# Altium schematic sheet BS-02-A1AJ0101_BS-02-A1AJ010.schdoc
size 127 x 99 mm
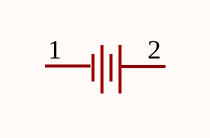
[diagram p0: BS-02-A1AJ0101_BS-02-A1AJ010.schdoc]

## Parts
B?  BS-02-A1AJ010  [BAT-TH_BS-02-A1AJ010]  (value not drawn)

## Nets

Not connected (* = marked no-connect by the designer): B? 1 2

## Library data of the parts
B? = BS-02-A1AJ010: Manufacturer: MYOUNG(美阳); Add into BOM: yes; Connector Type: 电池底座; Battery Type: CR2032; Symbol: BS-02-A1AJ010; Device: BS-02-A1AJ010; LCSC Part Name: 电池底座 适用电池:CR2032; Supplier Part: C5239862; Manufacturer Part: BS-02-A1AJ010; Supplier Footprint: 插件; JLCPCB Part Class: Extended Part; Datasheet: https://item.szlcsc.com/datasheet/BS-02-A1AJ010/5943286.html; Supplier: LCSC; Convert to PCB: yes; Contact Material: 磷青铜; Contact Plating: 镍; Operating Temperature: -25℃~+85℃